# Altium schematic sheet GPS_Module.SchDoc
size A4
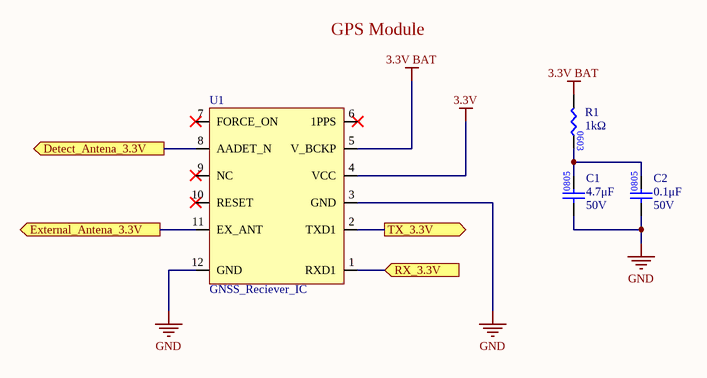
[diagram p0: GPS_Module.SchDoc]

## Parts
C1  value 4.7μF  Voltage Rating: 50V  [CAP0805]  (hidden comment: CAP_4.7uF_50V_0805)
C2  value 0.1μF  Voltage Rating: 50V  [CAP0805]  (hidden comment: CAP_0.1uF_50V_0805)
R1  value 1kΩ  [RES0603]  (hidden comment: RES_1kΩ_0603_5%)
U1  GNSS_Reciever_IC  [L86_M33_GNSS_Reciever_IC]

## Ports
Detect_Antena_3.3V (out), External_Antena_3.3V (out), RX_3.3V (in), TX_3.3V (out)

## Nets
3.3V: U1.4(VCC)
3.3V BAT: R1.1 U1.5(V_BCKP)
GND: C1.1 C2.1 U1.3(GND) U1.12(GND)
Detect_Antena_3.3V: U1.8(AADET_N) ; port Detect_Antena_3.3V
External_Antena_3.3V: U1.11(EX_ANT) ; port External_Antena_3.3V
RX_3.3V: U1.1(RXD1) ; port RX_3.3V
TX_3.3V: U1.2(TXD1) ; port TX_3.3V
NetC1_2: C1.2 C2.2 R1.2

Not connected (* = marked no-connect by the designer): U1 6(1PPS)* 7(FORCE_ON)* 9(NC)* 10(RESET)*

## Notes on the sheet
- GPS Module

## Library data of the parts
C1 = CAP_4.7uF_50V_0805: CAP CER 4.7UF 50V X5R 0805; Manufacturer 1: TDK Corporation; Manufacturer Part Number 1: CGA4J3X5R1H475K125AB; Mounting Type: SMD; Supplier 1: Digi-Key; Supplier Part Number 1: 445-7882-1-ND; Package: 0805; LCSC Part #: C1779; Dielectric: X5R
C2 = CAP_0.1uF_50V_0805: CAP CER 0.1UF 50V X7R 0805; Manufacturer 1: Murata Electronics; Manufacturer Part Number 1: GCM21BR71H104KA37K; Package/Footprint: 0805; Mounting Type: SMD; Supplier 1: Digi-Key; Supplier Part Number 1: 490-8049-1-ND; Dielectric: X7R; LCSC Part #: C49678
R1 = RES_1kΩ_0603_5%: RES 1K OHM 5% 1/10W 0603; Manufacturer 1: Yageo; Manufacturer Part Number 1: RC0603JR-071KL; Supplier Part Number 1: 311-1.0KGRCT-ND; Supplier 1: Digi-Key; Mounting Type: SMD; Package: 0603
U1 = GNSS_Reciever_IC: Navigation Galileo, GLONASS, GPS, GNSS Transceiver Module 1.575GHz, 1.601GHz Integrated, Ceramic Patch Surface Mount; Manufacturer: Quectel; Manufacturer Product Number: L86-M33; Voltage supply: 3V ~ 4.3V; Mounting type: Surface Mount; Supplier: DigiKey; Package: LCC; ComponentLink1Description: Digikey Link; ComponentLink1URL: https://www.digikey.ca/en/products/detail/quectel/L86-M33/13278361; ComponentLink2Description: Datasheet Link; ComponentLink2URL: https://www.mouser.ca/datasheet/2/1052/QWSC_S_A0007269014_1-2576162.pdf